# EAGLE design comparator_module (EAGLE 9.4.1)
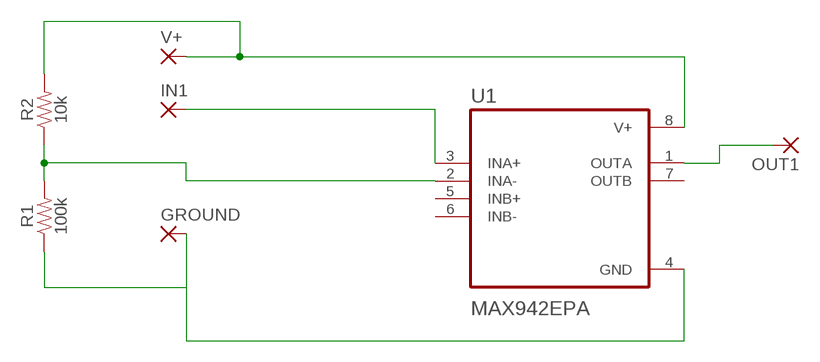
[diagram p0: schematic, sheet 1]

## Parts
GROUND  3,81/1,4  [3,81/1,4]
IN1  3,81/1,4  [3,81/1,4]
OUT1  3,81/1,4  [3,81/1,4]
R1  100k  15KOHM-HORIZ-1/4W-5%  [AXIAL-0.3]
R2  10k  15KOHM-HORIZ-1/4W-5%  [AXIAL-0.3]
U1  MAX942EPA  [DIP794W47P254L991H457Q8]
V+  3,81/1,4  [3,81/1,4]

## Nets
N$1: OUT1.1(P) U1.1(OUTA)
N$2: IN1.1(P) U1.3(INA+)
N$3: GROUND.1(P) R1.P$1 U1.4(GND)
N$6: R1.P$2 R2.P$1 U1.2(INA-)
N$7: R2.P$2 U1.8(V+) V+.1(P)
Unconnected: U1.5(INB+) U1.6(INB-) U1.7(OUTB)

## Library data of the parts
GROUND IN1 OUT1 V+ = wirepad:3,81/1,4: THROUGH-HOLE PAD
R1 R2 = SparkFun-Resistors:15KOHM: 15kΩ resistor A resistor is a passive two-terminal electrical component that implements electrical resistance as a circuit element. Resistors act to reduce current flow, and, at the same time, act to lower voltage levels within circuits. - Wikipedia; PROD_ID: RES-11360; VALUE: 15k
U1 = MAX942EPA:MAX942EPA; DESCRIPTION: Linear IC - Comparator Maxim Integrated MAX942EPA+ Multi-purpose CMOS, Push pull, TTL PDIP 8; DIGI-KEY_PART_NUMBER: MAX942EPA+-ND; DIGI-KEY_PURCHASE_URL: https://www.digikey.com/product-detail/en/maxim-integrated/MAX942EPA-/MAX942EPA--ND/1495026?utm_source=snapeda&utm_medium=aggregator&utm_campaign=symbol; MF: Maxim Integrated; MP: MAX942EPA+; PACKAGE: PDIP-8 Maxim

## Board
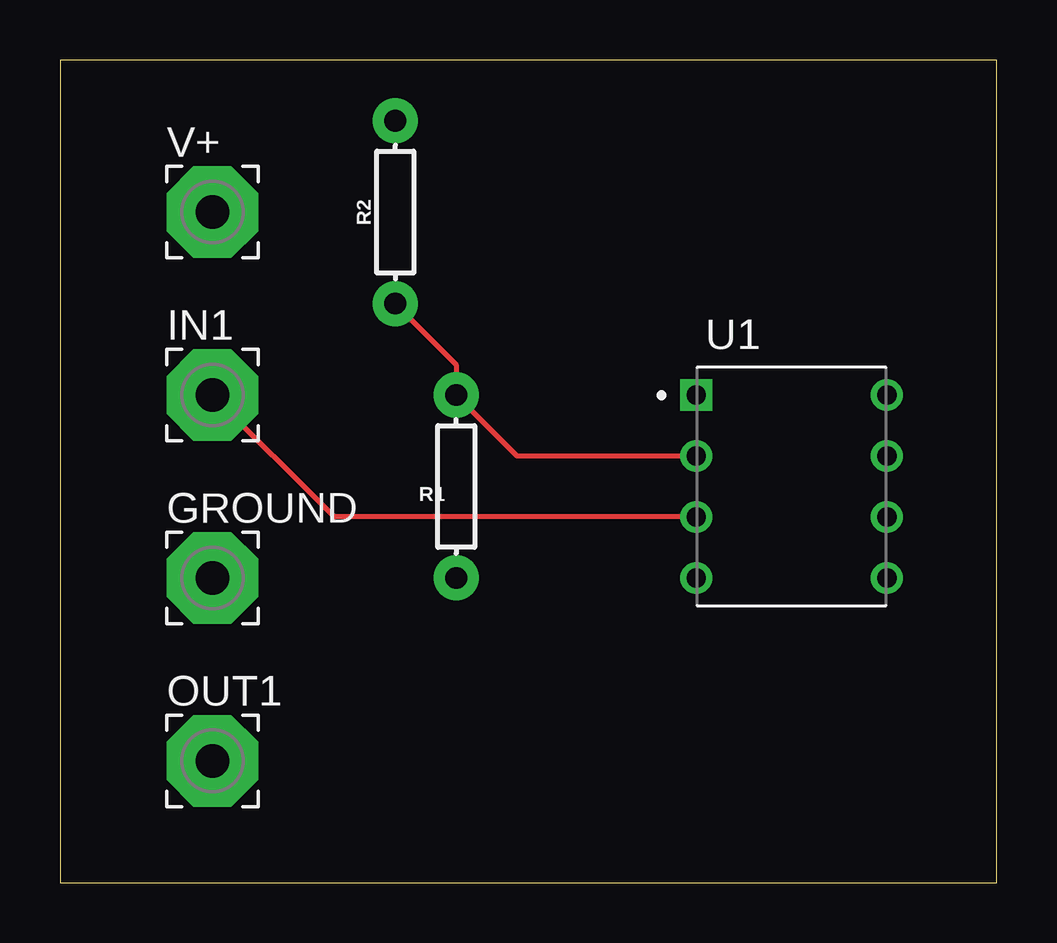
[diagram p1: board, top side]
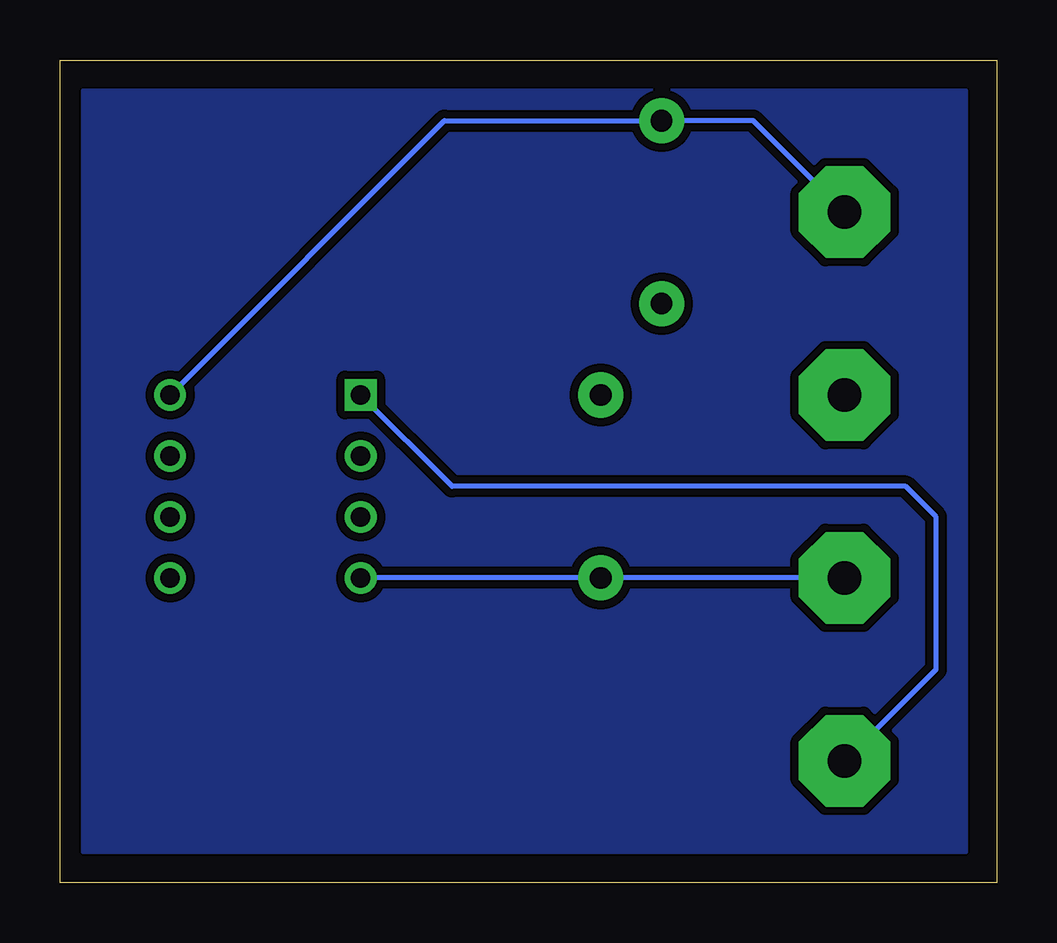
[diagram p2: board, bottom side, seen from below]

Size 39.04 x 34.28 mm. Coordinates in mm from the lower left corner, seen from the top.
Outline: 0,0 39.04,0 39.04,34.28 0,34.28 0,0
Copper layers (1*16): Top 0.07mm / dielectric 1.5mm / Bottom 0.07mm
Design rules "Advanced *": minimum track width 6mil, minimum drill 0.2mm, track to track 14mil, track to pad 10mil, pad to pad 10mil, via to via 10mil, smd to smd 10mil, copper to edge 20mil, drill to drill 10mil, minimum pad ring 10mil, minimum via ring 8mil, stop-mask expansion 4mil, vias tented up to drill 0mil, thermal gap 10mil

### Footprints (pad centres in the part's own frame; a part is rotated, then mirrored left to right if it is on the bottom)
3,81/1,4 = drill 1.397 pad 3.81 octagon: 1 0,0
AXIAL-0.3 = drill 0.9 pad 1.88: P$1 -3.81,0; P$2 3.81,0
DIP794W47P254L991H457Q8 = drill 0.81 pad 1.22 square: 1 -3.97,3.81 | drill 0.81 pad 1.22: 2 -3.97,1.27; 3 -3.97,-1.27; 4 -3.97,-3.81; 5 3.97,-3.81; 6 3.97,-1.27; 7 3.97,1.27; 8 3.97,3.81

### Placement (x,y rotation side)
GROUND  6.35,12.7 0 top
IN1  6.35,20.32 0 top
OUT1  6.35,5.08 0 top
R1  16.51,16.51 90 top
R2  13.97,27.94 90 top
U1  30.48,16.51 0 top
V+  6.35,27.94 0 top

### Tracks (layer width: path | path; a pad name or v marks a point on that pad's centre or on a via)
COMP
  pour Bottom: 1.27,33.02 1.27,1.27 38.1,1.27 38.1,33.02
N$1
  Bottom 0.203: OUT1.1 2.54,8.89 2.54,15.24 3.81,16.51 22.7,16.51 U1.1
N$2
  Top 0.203: U1.3 11.43,15.24 IN1.1
N$3
  Bottom 0.203: GROUND.1 R1.P$1 U1.4
N$6
  Top 0.203: R2.P$1 16.51,21.59 R1.P$2 19.05,17.78 U1.2
N$7
  Top 0.203: U1.8 34.29,20.48
  Bottom 0.203: U1.8 23.02,31.75 R2.P$2 10.16,31.75 V+.1